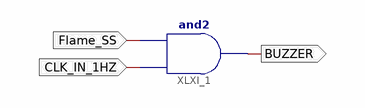
[diagram p0: schematic sheet 1]
// Xilinx ISE schematic Alarm_Fire.sch (spartan6) as structural Verilog: 1 symbols, 3 ports
module Alarm_Fire (
  input  Flame_SS,
  input  CLK_IN_1HZ,
  output BUZZER
);

  and XLXI_1 (BUZZER, CLK_IN_1HZ, Flame_SS);
endmodule
